# Altium schematic sheet TopSheet.SchDoc
size A4; CompanyName: Technische Hochschule Nürnberg Georg Simon Ohm; Organization: UltraZohm; Address1: Kesslerplatz 12; Address2: 90489 Nürnberg; Address3: GERMANY; DocumentNumber: 1; SheetNumber: 1; SheetTotal: 5; Website: www.ultrazohm.com
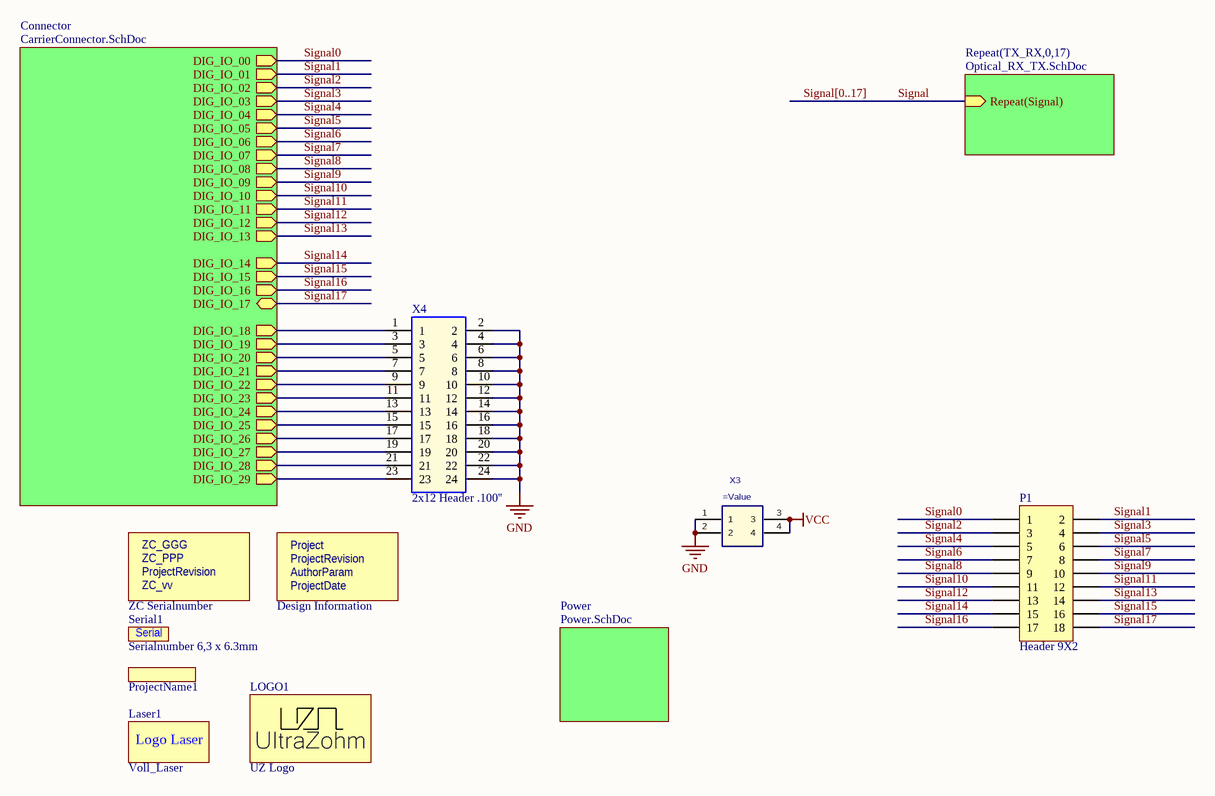
[diagram p0: TopSheet.SchDoc]

## Parts
(Parts that share a designator on the sheet are numbered #1, #2 ... from top to bottom, then left to right.)
?#1  ZC Serialnumber  [ZC-Serial]  (no BOM)
?#2  Design Information  [Design_info2]  (no BOM)
Laser1  Voll_Laser  [Voll_Laser]  (no BOM)
LOGO1  UZ Logo  [UZ_Logo_small]  (no BOM)
P1  Header 9X2  [HDR2X9]
ProjectName1  Project Name, Rev  [ID_ProjectRev]  (value not drawn)  (no BOM)
Serial1  Serialnumber 6,3 x 6.3mm  [Serial_6.3x6.3mm]  (no BOM)
X3  (no value)  [IPL1-102-01-L-D-K]
X4  2x12 Header .100''  [TST-112-01-G-D]

## Sub-sheets
Connector = CarrierConnector.SchDoc: DIG_IO_05 (out), DIG_IO_09 (out), DIG_IO_01 (out), DIG_IO_07 (out), DIG_IO_08 (out), DIG_IO_06 (out), DIG_IO_04 (out), DIG_IO_16 (out), DIG_IO_12 (out), DIG_IO_15 (out), DIG_IO_02 (out), DIG_IO_03 (out), DIG_IO_11 (out), DIG_IO_14 (out), DIG_IO_13 (out), DIG_IO_10 (out), DIG_IO_27 (out), DIG_IO_26 (out), DIG_IO_17 (bidir), DIG_IO_19 (out), DIG_IO_29 (out), DIG_IO_24 (out), DIG_IO_22 (out), DIG_IO_28 (out), DIG_IO_21 (out), DIG_IO_23 (out), DIG_IO_25 (out), DIG_IO_18 (out), DIG_IO_20 (out), DIG_IO_00 (out)
Power = Power.SchDoc: no entries
Repeat(TX_RX,0,17) = Optical_RX_TX.SchDoc: Repeat(Signal) (in)

## Nets
GND: X3.1 X3.2 X4.2 X4.4 X4.6 X4.8 X4.10 X4.12 X4.14 X4.16 X4.18 X4.20 X4.22 X4.24
VCC: X3.3 X3.4
Signal: sheet Repeat(TX_RX,0,17)/Repeat(Signal)
Signal0: P1.1 ; sheet Connector/DIG_IO_00
Signal1: P1.2 ; sheet Connector/DIG_IO_01
Signal2: P1.3 ; sheet Connector/DIG_IO_02
Signal3: P1.4 ; sheet Connector/DIG_IO_03
Signal4: P1.5 ; sheet Connector/DIG_IO_04
Signal5: P1.6 ; sheet Connector/DIG_IO_05
Signal6: P1.7 ; sheet Connector/DIG_IO_06
Signal7: P1.8 ; sheet Connector/DIG_IO_07
Signal8: P1.9 ; sheet Connector/DIG_IO_08
Signal9: P1.10 ; sheet Connector/DIG_IO_09
Signal10: P1.11 ; sheet Connector/DIG_IO_10
Signal11: P1.12 ; sheet Connector/DIG_IO_11
Signal12: P1.13 ; sheet Connector/DIG_IO_12
Signal13: P1.14 ; sheet Connector/DIG_IO_13
Signal14: P1.15 ; sheet Connector/DIG_IO_14
Signal15: P1.16 ; sheet Connector/DIG_IO_15
Signal16: P1.17 ; sheet Connector/DIG_IO_16
Signal17: P1.18 ; sheet Connector/DIG_IO_17
NetX4_1: X4.1 ; sheet Connector/DIG_IO_18
NetX4_3: X4.3 ; sheet Connector/DIG_IO_19
NetX4_5: X4.5 ; sheet Connector/DIG_IO_20
NetX4_7: X4.7 ; sheet Connector/DIG_IO_21
NetX4_9: X4.9 ; sheet Connector/DIG_IO_22
NetX4_11: X4.11 ; sheet Connector/DIG_IO_23
NetX4_13: X4.13 ; sheet Connector/DIG_IO_24
NetX4_15: X4.15 ; sheet Connector/DIG_IO_25
NetX4_17: X4.17 ; sheet Connector/DIG_IO_26
NetX4_19: X4.19 ; sheet Connector/DIG_IO_27
NetX4_21: X4.21 ; sheet Connector/DIG_IO_28
NetX4_23: X4.23 ; sheet Connector/DIG_IO_29

## Buses and harness runs
bus Signal[0..17]

## Notes on the sheet
- Title
- Revision:
- Design Engineer:
- Date:
- Project:
- Sheet
- of
- (in symbol Design Information) Project; ProjectRevision; AuthorParam; ProjectDate
- (in symbol SerialNumber) Serial
- (in symbol Voll_Laser) Logo Laser
- (in symbol ZC-Serial) ZC_GGG; ZC_PPP; ProjectRevision; ZC_vv

## Library data of the parts
?#1 = ZC-Serial: Manufacturer: UltraZohm; Value: GGG-PPP-VVvv; Created from: FRosner; Manufacturer Part Number: ZC-Serial; PartID: 58; Created On: 15.04.2025 09:17:14; ComponentLink1Description: https://docs.ultrazohm.com/; ComponentLink1URL: homepage; Component Type: ZC Serialnumber; Last Updated: 15.04.2025 09:17:14; Supplier 1: -; Supplier Part Number 1: -; Type: Serial Number; Live Cycle Status: 1
?#2 = Design Information: Manufacturer: UltraZohm; Created from: MGremer; Manufacturer Part Number: Design Information; PartID: 12; Created On: 03.11.2021 09:04:23; ComponentLink1Description: https://docs.ultrazohm.com/; ComponentLink1URL: homepage; Component Type: Design Information; Last Updated: 15.04.2025 09:29:36; Supplier 1: -; Supplier Part Number 1: -; Type: Design Information; Value: Design Information; Live Cycle Status: 1
Laser1 = Voll_Laser: Logo Laser Warning Sign
LOGO1 = UZ Logo: UltraZohm Logo on PCB; Created: Jan2021_Liegmann; Value: UZ Logo
P1 = Header 9X2: Header, 9-Pin, Dual row; LatestRevisionDate: 17-Jul-2002; LatestRevisionNote: Re-released for DXP Platform.; Publisher: Altium Limited
ProjectName1 = ID_ProjectRev: Project Name and Revision Number; Created: 2018_11_23_AGeiger; Value: Project Name, Rev
Serial1 = SerialNumber: Created: 2018_09_18_AGeiger; Value: Serialnumber 6,3 x 6.3mm
X3 = IPL1-102-XX-X-D-X: 2.54mm Double Row Terminal Assembly, Right-Angled; Manufacturer: SAMTEC; Created: 2018_05_02_AGeiger; Value: =MPN; MPN: IPL1-102-01-L-D-K
X4 = TST-112-01-G-D: Double Row, 12 positions, Shrouded Terminal Header .100''; MF: Samtec; Created: 2020_04_Kreppel; MPN: TST-112-01-G-D; Supplier 1: Mouser; Supplier Part Number 1: 200-TST11201GD